# EAGLE schematic ReflowController Alternate micro (EAGLE 7.6.0)
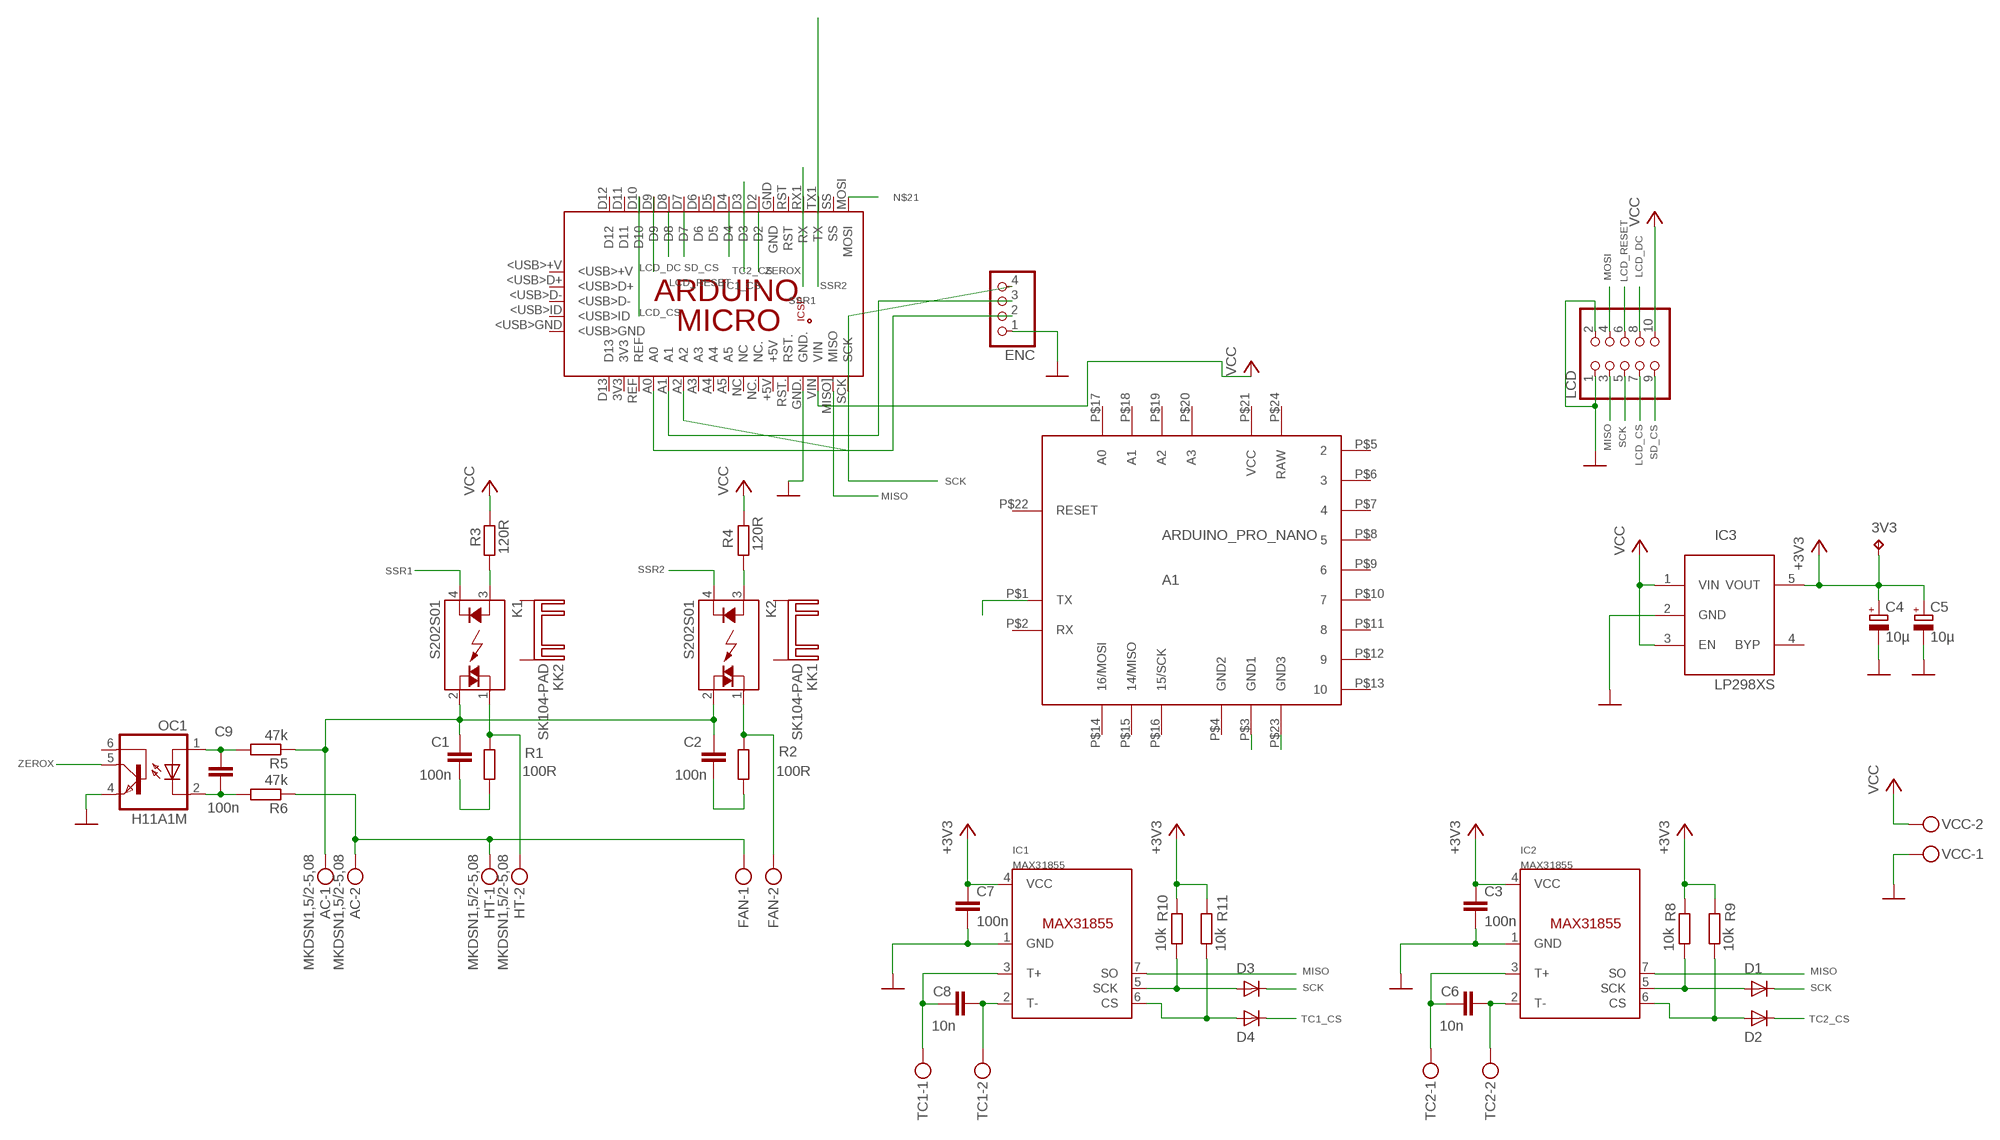
[diagram p0: schematic, sheet 1]

## Parts
3V3  TPTP08R  [TP08R]
A1  ARDUINO_PRO_NANO  [ARDUINO_PRO_NANO]
AC  MKDSN1,5/2-5,08  [MKDSN1,5/2-5,08]
C1  100n  CXXC10B5  [XC10B5]
C2  100n  CXXC10B5  [XC10B5]
C3  100n  C-EUC0805  [C0805]
C4  10µ  CPOL-EUC/6032-28R  [C/6032-28R]
C5  10µ  CPOL-EUC/6032-28R  [C/6032-28R]
C6  10n  C-EUC0603  [C0603]
C7  100n  C-EUC0805  [C0805]
C8  10n  C-EUC0603  [C0603]
C9  100n  C-EU025-025X050  [C025-025X050]
D1  DIODESOD-123  [SOD-123]
D2  DIODESOD-123  [SOD-123]
D3  DIODESOD-123  [SOD-123]
D4  DIODESOD-123  [SOD-123]
ENC  PINHD-1X4  [1X04]
FAN  MKDSN1,5/2-5,08  [MKDSN1,5/2-5,08]
HT  MKDSN1,5/2-5,08  [MKDSN1,5/2-5,08]
IC1  MAX31855  [SOIC8]
IC2  MAX31855  [SOIC8]
IC3  LP298XS  [SOT23-5L]
K1  S202S01  [S102S01]
K2  S202S01  [S102S01]
KK1  SK104-PAD  [SK104-PAD]
KK2  SK104-PAD  [SK104-PAD]
LCD  PINHD-2X5  [2X05]
OC1  H11A1M  [DIL06]
PCB1  ARDUINO_MICRO  [ARDUINO_MICRO]
R1  100R  R-EU_0207/5V  [0207/5V]
R2  100R  R-EU_0207/5V  [0207/5V]
R3  120R  R-EU_R0603  [R0603]
R4  120R  R-EU_R0603  [R0603]
R5  47k  R-EU_0207/5V  [0207/5V]
R6  47k  R-EU_0207/5V  [0207/5V]
R8  10k  R-EU_R0603  [R0603]
R9  10k  R-EU_R0603  [R0603]
R10  10k  R-EU_R0603  [R0603]
R11  10k  R-EU_R0603  [R0603]
TC1  MKDSN1,5/2-5,08  [MKDSN1,5/2-5,08]
TC2  MKDSN1,5/2-5,08  [MKDSN1,5/2-5,08]
VCC  MKDSN1,5/2-5,08  [MKDSN1,5/2-5,08]

## Nets
+3V3: 3V3.TP C3.1 C4.+ C5.+ C7.1 IC1.4(VCC) IC2.4(VCC) IC3.5(VOUT) R8.2 R9.2 R10.2 R11.2
AC1: AC.1 C1.1 C2.1 K1.2(DS2) K2.2(DS2) R5.1
AC2: AC.2 FAN.1 HT.1 R6.1
AC_OUT1: HT.2 K1.1(DS1) R1.2
AC_OUT2: FAN.2 K2.1(DS1) R2.2
GND: C3.2 C4.- C5.- C7.2 ENC.1 IC1.1(GND) IC2.1(GND) IC3.2(GND) LCD.1 LCD.2 OC1.4(EMI) PCB1.GND. VCC.1
LCD_CS: LCD.7 PCB1.D10
LCD_DC: LCD.8 PCB1.D9
LCD_RESET: LCD.6
MISO: IC1.7(SO) IC2.7(SO) LCD.3 PCB1.MISO](MISO)
MOSI: LCD.4
N$1: C8.2 IC1.2(T-) TC1.2
N$2: C6.2 IC2.2(T-) TC2.2
N$3: C6.1 IC2.3(T+) TC2.1
N$4: ENC.2 PCB1.A0
N$5: ENC.3 PCB1.A1
N$6: C1.2 R1.1
N$7: C2.2 R2.1
N$8: ENC.4 PCB1.A2
N$9: C9.1 OC1.1(A) R5.2
N$10: C9.2 OC1.2(C) R6.2
N$11: C8.1 IC1.3(T+) TC1.1
N$13: K1.3(A) R3.2
N$14: K2.3(A) R4.2
N$15: D2.A IC2.6(CS) R9.1
N$16: D1.A IC2.5(SCK) R8.1
N$17: D4.A IC1.6(CS) R11.1
N$18: D3.A IC1.5(SCK) R10.1
N$19: A1.P$23(GND3)
N$20: A1.P$3(GND1)
N$21: PCB1.MOSI
SCK: D1.C D3.C LCD.5 PCB1.SCK
SD_CS: LCD.9
SSR1: K1.4(K)
SSR2: K2.4(K)
TC1_CS: D4.C
TC2_CS: D2.C
VCC: IC3.1(VIN) IC3.3(EN) LCD.10 PCB1.VIN R3.1 R4.1 VCC.2
ZEROX: OC1.5(COL)
Unconnected: A1.P$1(TX) A1.P$2(RX) A1.P$5 A1.P$6 A1.P$7 A1.P$8 A1.P$9 A1.P$10 A1.P$11 A1.P$12 A1.P$13 A1.P$14(16/MOSI) A1.P$15(14/MISO) A1.P$16(15/SCK) A1.P$17(A0) A1.P$18(A1) A1.P$19(A2) A1.P$20(A3) A1.P$22(RESET) IC3.4(BYP) KK1.K1(K) KK1.K2(K) KK2.K1(K) KK2.K2(K) OC1.6(BAS) PCB1.3V3 PCB1.5V PCB1.+5V PCB1.<USB>+V PCB1.<USB>D+ PCB1.<USB>D- PCB1.<USB>GND PCB1.<USB>ID PCB1.A3 PCB1.A4 PCB1.A5 PCB1.D2 PCB1.D3 PCB1.D4 PCB1.D5 PCB1.D6 PCB1.D7 PCB1.D8 PCB1.D11 PCB1.D12 PCB1.D13 PCB1.GND PCB1.GND_ PCB1.MISO. PCB1.MOSI. PCB1.NC PCB1.NC. PCB1.REF PCB1.RESET.. PCB1.RST PCB1.RST. PCB1.RX1(RX) PCB1.SCK. PCB1.SS PCB1.TX1(TX)

## Power pins joined to a net without a drawn wire
GND2: A1.P$4(GND2)
RAW: A1.P$24(RAW)
VCC: A1.P$21(VCC)

## Library data of the parts
3V3 = testpad:TP: Test pad
A1 = pit:ARDUINO_PRO_NANO: SparkFun Arduino Pro Nano
AC FAN HT TC1 TC2 VCC = con-phoenix-508:MKDSN1,5/2-5,08: MKDSN 1,5/ 2-5,08 Printklemme Nennstrom: 13,5 A Nennspannung: 250 V Rastermaß: 5,08 mm Polzahl: 2 Anschlussart: Schraubanschluss Montage: Löten Anschlussrichtung Leiter/Platine: 0 ° Artikelnummer: 1729128 Source: http://eshop.phoenixcontact.com .. 1729128.pdf; MPN: MKDSN 1,5/2-5.08; OC_FARNELL: 1792903; OC_NEWARK: 30M2397
C1 C2 = rcl:CX: X CAPACITOR for power line
C3 C6-C9 = rcl:C-EU: CAPACITOR, European symbol
C4 C5 = rcl:CPOL-EU: POLARIZED CAPACITOR, European symbol
D1-D4 = adafruit:DIODE: Diode SMADIODE - SMA Surface Mount Package 20V 1A Schottky Diode Digikey: 641-1014-6-ND DO-1N4148 - Through Hole Small Current Diode SOD-123 20V 1 A (.5mV Vf) Schottky Diode - Digikey: MBRX120TPMSCT-ND SOD-323 10V 570mA (.38mV Vf, 3ns) Schottky Diode - Digikey: ZLLS410CT-ND SOD-523 30V 30mA Schottky Diode (RB751S-40TE61) - Digikey: RB751S-40TE61CT-ND SOT23-R/W - SOT23 Package (R = Solder Paste/Reflow Ovens, W = Hand-Soldering) BAT54Film 40V 300mA - Digikey: 497-7162-1-ND
ENC = pinhead:PINHD-1X4: PIN HEADER
IC1 IC2 = AlexW-Eagle-Libraries:MAX31855
IC3 = adafruit:LP298X
K1 K2 = relay:S?*: Low Height Type Solid State Relays SHARP Source: 162574-da-01-en-S202T02_Solid_State_Relais.pdf Source: http://sharp-world.com .. s102s11_e.pdf; MPN: S202S01F; OC_FARNELL: 1618474; OC_NEWARK: 14N9587
KK1 KK2 = heatsink:SK104-PAD: HEATSINK manufacturer Fischer/distributor Buerklin
LCD = pinhead:PINHD-2X5: PIN HEADER
OC1 = optocoupler:H11A*?M: General Purpose 6-Pin Phototransistor Optocouplers Source: http://www.fairchildsemi.com/ds/4N/4N35-M.pdf; MPN: H11A1-M; OC_FARNELL: 1021358; OC_NEWARK: 97K1793
PCB1 = E14_Arduino_revB:ARDUINO_MICRO: Device for representing an Arduino Micro board with a footprint in an EAGLE design. Created by Dave Young for Element14. More EAGLE documentation at: http://www.element14.com/community/community/knode/cadsoft_eagle
R1-R6 R8-R11 = rcl:R-EU_: RESISTOR, European symbol